# Altium schematic sheet int_req.SchDoc
size 209 x 297 mm; SheetNumber: 7; SheetTotal: 7
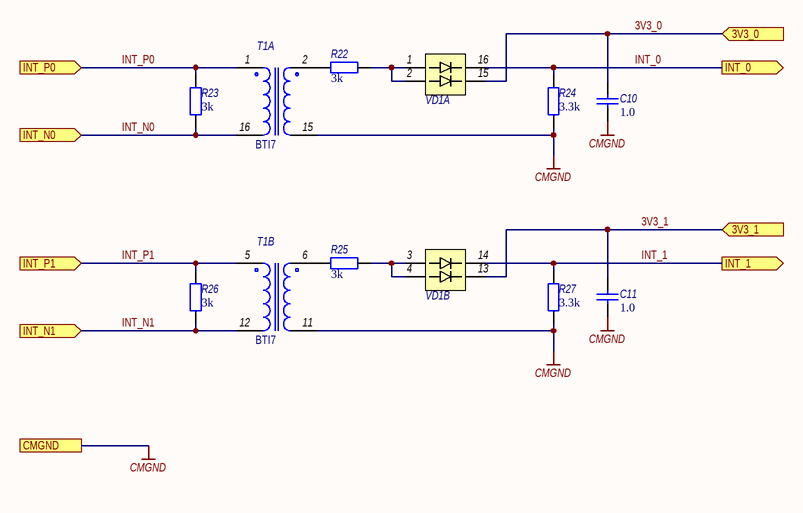
[diagram p0: int_req.SchDoc]

## Parts
C10  1.0  [SMD_0805]
C11  1.0  [SMD_0805]
R22  3k  [SMD_0805]
R23  3k  [SMD_0805]
R24  3.3k  [SMD_0805]
R25  3k  [SMD_0805]
R26  3k  [SMD_0805]
R27  3.3k  [SMD_0805]
T1  BTI7  [BTI7]  (parts A,B of 2)
VD1  2DS627A OSM  [401.16-3]  (value not drawn)  (parts A,B of 4)

## Ports
3V3_0 (in), 3V3_1 (in), CMGND, INT_0 (out), INT_1 (out), INT_N0 (in), INT_N1 (in), INT_P0 (in), INT_P1 (in)

## Nets
CMGND: C10.1 C11.1 R24.1 R27.1 T1.11 T1.15 ; port CMGND
3V3_0: C10.2 VD1.15(2B) ; port 3V3_0
3V3_1: C11.2 VD1.13(2D) ; port 3V3_1
INT_0: R24.2 VD1.16(2A) ; port INT_0
INT_1: R27.2 VD1.14(2C) ; port INT_1
INT_N0: R23.1 T1.16 ; port INT_N0
INT_N1: R26.1 T1.12 ; port INT_N1
INT_P0: R23.2 T1.1 ; port INT_P0
INT_P1: R26.2 T1.5 ; port INT_P1
NetR22_1: R22.1 VD1.1(1A) VD1.2(1B)
NetR22_2: R22.2 T1.2
NetR25_1: R25.1 VD1.3(1C) VD1.4(1D)
NetR25_2: R25.2 T1.6

## Notes on the sheet
- Перв. примен.
- Справ. №
- Подп. и дата
- Инв. № дубл.
- Взам. инв. №
- Разраб.
- Изм.
- Лист
- № докум.
- Подп.
- Дата
- Литера
- Масса
- Масштаб
- Пров.
- Т.контр.
- Листов
- Инв. № подл.
- Н.контр.
- Утв.
- Форма 1 ГОСТ 2.104-2006
- Копировал
- Формат А4

## Library data of the parts
C10 C11 = Capacitor: Назначение: ЧИП-конденсатор; Наименование: К10-79 МП0 «ВП»; Published: 8-Jun-2000; Revision: July-2002: Re-released for DXP Platform.; Publisher: Altium Limited; Value: 1.0
R22-R27 = Resistor: Назначение: ЧИП-резистор; Наименование: Р1-12-0.125 ОСМ; Published: 8-Jun-2000; Revision: July-2002: Re-released for DXP Platform.; Publisher: Altium Limited
  R22 R23 R25 R26: Value: 3k
  R24 R27: Value: 3.3k
T1 = BTI7: Блок трансформаторов; Наименование: БТИ7; Назначение: Трансформатор; Потребление, Вт: -; ComponentLink1Description: DataSheet; ComponentLink1URL: https://www.anion.ru/assets/images/scan/bti7-56v-1990-05.jpg
VD1 = 2DS627A_4p: Диодная матрица; Потребление, Вт: 0,0; Назначение: Диодная матрица; ComponentLink1Description: DataSheet; ComponentLink1URL: https://www.integral.by/sites/default/files/pdf/2ds627a.pdf